# Altium schematic sheet POWER_MCU.SchDoc
size C; SheetNumber: 9; SheetTotal: 9
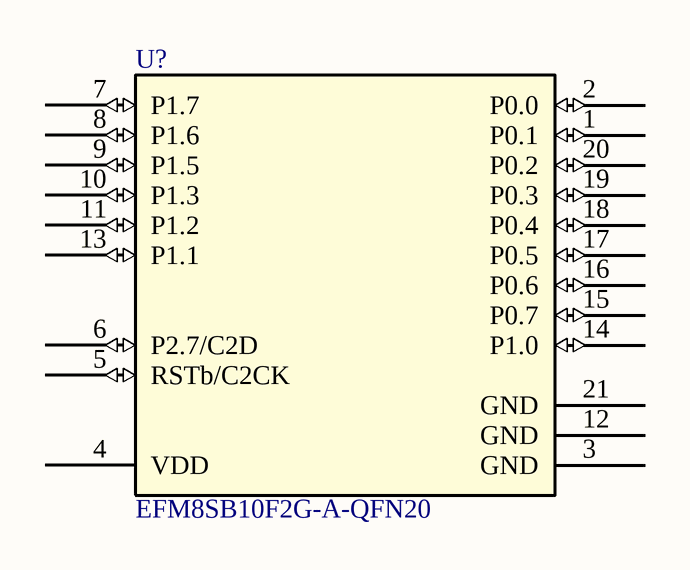
[diagram p0: POWER_MCU.SchDoc]

## Parts
U?  EFM8SB10F2G-A-QFN20  [EFM8SB10F2G-A-QFN20-Footprint-1]

## Nets

Not connected (* = marked no-connect by the designer): U? 1(P0.1) 2(P0.0) 3(GND) 4(VDD) 5(RSTb/C2CK) 6(P2.7/C2D) 7(P1.7) 8(P1.6) 9(P1.5) 10(P1.3) 11(P1.2) 12(GND) 13(P1.1) 14(P1.0) 15(P0.7) 16(P0.6) 17(P0.5) 18(P0.4) 19(P0.3) 20(P0.2) 21(GND)

## Library data of the parts
U? = CMP-020-00026-1: 8 Bit Microcontroller, Sleepy Bee, EFM8SB1, 25 MHz, 2 KB, 256 Byte, 20, QFN RoHS Compliant: Yes